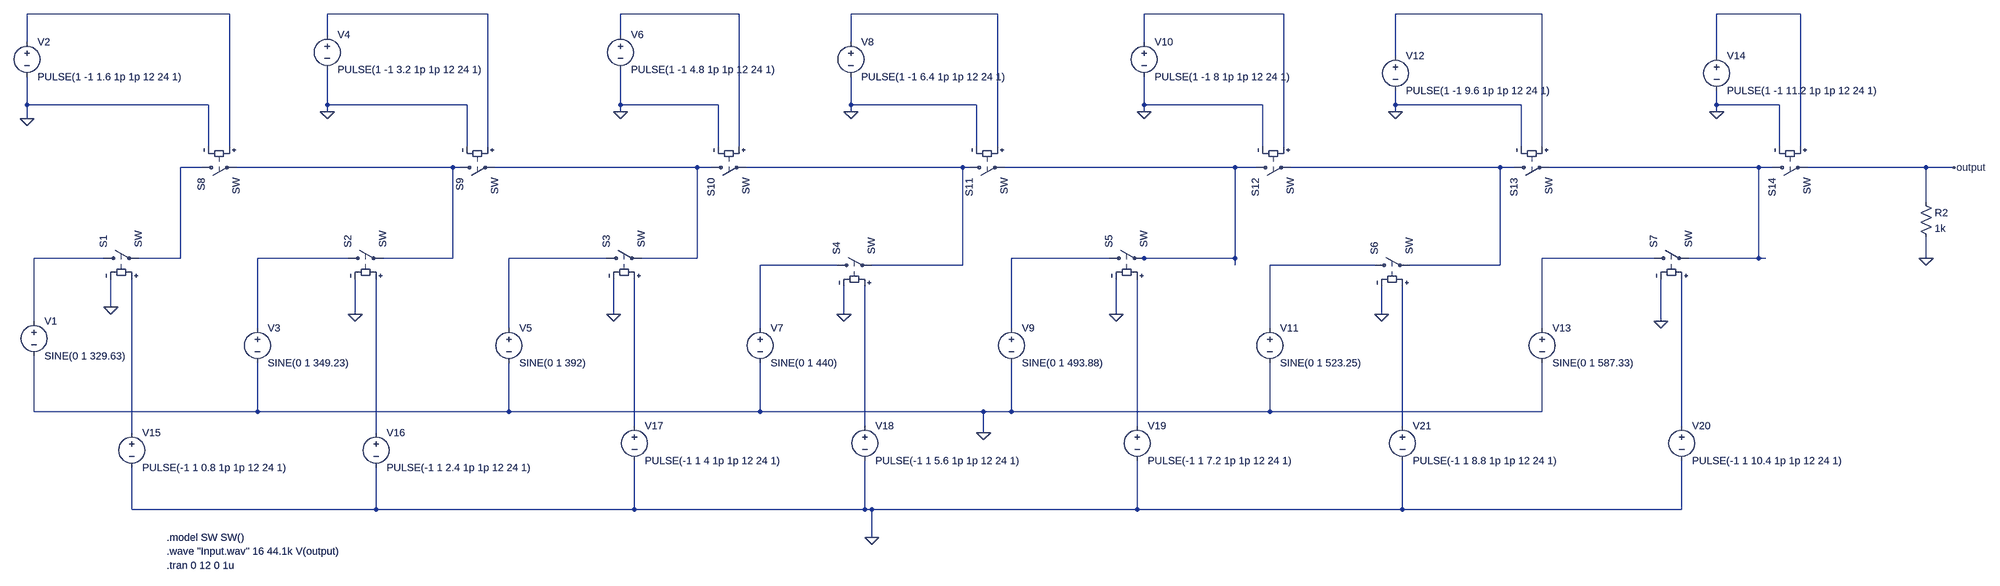
[diagram p0: schematic InputCircuit.asc]
InputCircuit.asc, the LTspice schematic file:
Version 4
SHEET 1 4720 688
WIRE 432 -592 -32 -592
WIRE 1024 -592 656 -592
WIRE 1600 -592 1328 -592
WIRE 2192 -592 1856 -592
WIRE 2848 -592 2528 -592
WIRE 3440 -592 3104 -592
WIRE 4032 -592 3840 -592
WIRE 656 -544 656 -592
WIRE 1328 -544 1328 -592
WIRE -32 -528 -32 -592
WIRE 1856 -528 1856 -592
WIRE 2528 -528 2528 -592
WIRE 3104 -496 3104 -592
WIRE 3840 -496 3840 -592
WIRE -32 -384 -32 -448
WIRE 384 -384 -32 -384
WIRE 656 -384 656 -464
WIRE 976 -384 656 -384
WIRE 1328 -384 1328 -464
WIRE 1552 -384 1328 -384
WIRE 1856 -384 1856 -448
WIRE 2144 -384 1856 -384
WIRE 2528 -384 2528 -448
WIRE 2800 -384 2528 -384
WIRE 3104 -384 3104 -416
WIRE 3392 -384 3104 -384
WIRE 3840 -384 3840 -416
WIRE 3984 -384 3840 -384
WIRE 656 -368 656 -384
WIRE 1328 -368 1328 -384
WIRE 1856 -368 1856 -384
WIRE 2528 -368 2528 -384
WIRE 3104 -368 3104 -384
WIRE 3840 -368 3840 -384
WIRE -32 -352 -32 -384
WIRE 384 -288 384 -384
WIRE 432 -288 432 -592
WIRE 976 -288 976 -384
WIRE 1024 -288 1024 -592
WIRE 1552 -288 1552 -384
WIRE 1600 -288 1600 -592
WIRE 2144 -288 2144 -384
WIRE 2192 -288 2192 -592
WIRE 2800 -288 2800 -384
WIRE 2848 -288 2848 -592
WIRE 3392 -288 3392 -384
WIRE 3440 -288 3440 -592
WIRE 3984 -288 3984 -384
WIRE 4032 -288 4032 -592
WIRE 368 -240 320 -240
WIRE 944 -240 448 -240
WIRE 960 -240 944 -240
WIRE 1504 -240 1040 -240
WIRE 1536 -240 1504 -240
WIRE 2112 -240 1616 -240
WIRE 2128 -240 2112 -240
WIRE 2736 -240 2208 -240
WIRE 2784 -240 2736 -240
WIRE 3344 -240 2864 -240
WIRE 3376 -240 3344 -240
WIRE 3936 -240 3456 -240
WIRE 3968 -240 3936 -240
WIRE 4320 -240 4048 -240
WIRE 4384 -240 4320 -240
WIRE 4320 -160 4320 -240
WIRE 144 -32 -16 -32
WIRE 320 -32 320 -240
WIRE 320 -32 224 -32
WIRE 704 -32 496 -32
WIRE 944 -32 944 -240
WIRE 944 -32 784 -32
WIRE 1296 -32 1072 -32
WIRE 1504 -32 1504 -240
WIRE 1504 -32 1376 -32
WIRE 2448 -32 2224 -32
WIRE 2528 -32 2512 -32
WIRE 2736 -32 2736 -240
WIRE 2736 -32 2528 -32
WIRE 3696 -32 3440 -32
WIRE 3936 -32 3936 -240
WIRE 3936 -32 3776 -32
WIRE 3952 -32 3936 -32
WIRE 4320 -32 4320 -80
WIRE 1824 -16 1648 -16
WIRE 2112 -16 2112 -240
WIRE 2112 -16 1904 -16
WIRE 2736 -16 2736 -32
WIRE 3056 -16 2816 -16
WIRE 3344 -16 3344 -240
WIRE 3344 -16 3136 -16
WIRE 160 80 160 16
WIRE 720 96 720 16
WIRE 1312 96 1312 16
WIRE 1840 96 1840 32
WIRE 2464 96 2464 16
WIRE 3072 96 3072 32
WIRE -16 112 -16 -32
WIRE 3712 112 3712 16
WIRE 496 128 496 -32
WIRE 1072 128 1072 -32
WIRE 1648 128 1648 -16
WIRE 2224 128 2224 -32
WIRE 2816 128 2816 -16
WIRE 3440 128 3440 -32
WIRE -16 320 -16 192
WIRE 496 320 496 208
WIRE 496 320 -16 320
WIRE 1072 320 1072 208
WIRE 1072 320 496 320
WIRE 1648 320 1648 208
WIRE 1648 320 1072 320
WIRE 2160 320 1648 320
WIRE 2224 320 2224 208
WIRE 2224 320 2160 320
WIRE 2816 320 2816 208
WIRE 2816 320 2224 320
WIRE 3440 320 3440 208
WIRE 3440 320 2816 320
WIRE 1360 352 1360 16
WIRE 1888 352 1888 32
WIRE 2512 352 2512 16
WIRE 3120 352 3120 32
WIRE 3760 352 3760 16
WIRE 208 368 208 16
WIRE 768 368 768 16
WIRE 2160 368 2160 320
WIRE 208 544 208 448
WIRE 768 544 768 448
WIRE 768 544 208 544
WIRE 1360 544 1360 432
WIRE 1360 544 768 544
WIRE 1888 544 1888 432
WIRE 1888 544 1360 544
WIRE 1904 544 1888 544
WIRE 2512 544 2512 432
WIRE 2512 544 1904 544
WIRE 3120 544 3120 432
WIRE 3120 544 2512 544
WIRE 3760 544 3760 432
WIRE 3760 544 3120 544
WIRE 1904 608 1904 544
FLAG 160 80 0
FLAG 720 96 0
FLAG 1312 96 0
FLAG 1840 96 0
FLAG 2464 96 0
FLAG 3072 96 0
FLAG 3712 112 0
FLAG 2160 368 0
FLAG 1904 608 0
FLAG 4384 -240 output
FLAG 3840 -368 0
FLAG 3104 -368 0
FLAG 2528 -368 0
FLAG 1856 -368 0
FLAG 1328 -368 0
FLAG 656 -368 0
FLAG -32 -352 0
FLAG 4320 -32 0
SYMBOL voltage -16 96 R0
WINDOW 123 0 0 Left 0
WINDOW 39 0 0 Left 0
SYMATTR InstName V1
SYMATTR Value SINE(0 1 329.63)
SYMBOL voltage -32 -544 R0
WINDOW 123 0 0 Left 0
WINDOW 39 0 0 Left 0
SYMATTR InstName V2
SYMATTR Value PULSE(1 -1 1.6 1p 1p 12 24 1)
SYMBOL voltage 496 112 R0
WINDOW 123 0 0 Left 0
WINDOW 39 0 0 Left 0
SYMATTR InstName V3
SYMATTR Value SINE(0 1 349.23)
SYMBOL voltage 656 -560 R0
WINDOW 123 0 0 Left 0
WINDOW 39 0 0 Left 0
SYMATTR InstName V4
SYMATTR Value PULSE(1 -1 3.2 1p 1p 12 24 1)
SYMBOL voltage 1072 112 R0
WINDOW 123 0 0 Left 0
WINDOW 39 0 0 Left 0
SYMATTR InstName V5
SYMATTR Value SINE(0 1 392)
SYMBOL voltage 1328 -560 R0
WINDOW 123 0 0 Left 0
WINDOW 39 0 0 Left 0
SYMATTR InstName V6
SYMATTR Value PULSE(1 -1 4.8 1p 1p 12 24 1)
SYMBOL voltage 1648 112 R0
WINDOW 123 0 0 Left 0
WINDOW 39 0 0 Left 0
SYMATTR InstName V7
SYMATTR Value SINE(0 1 440)
SYMBOL voltage 1856 -544 R0
WINDOW 123 0 0 Left 0
WINDOW 39 0 0 Left 0
SYMATTR InstName V8
SYMATTR Value PULSE(1 -1 6.4 1p 1p 12 24 1)
SYMBOL voltage 2224 112 R0
WINDOW 123 0 0 Left 0
WINDOW 39 0 0 Left 0
SYMATTR InstName V9
SYMATTR Value SINE(0 1 493.88)
SYMBOL voltage 2528 -544 R0
WINDOW 123 0 0 Left 0
WINDOW 39 0 0 Left 0
SYMATTR InstName V10
SYMATTR Value PULSE(1 -1 8 1p 1p 12 24 1)
SYMBOL voltage 2816 112 R0
WINDOW 123 0 0 Left 0
WINDOW 39 0 0 Left 0
SYMATTR InstName V11
SYMATTR Value SINE(0 1 523.25)
SYMBOL voltage 3104 -512 R0
WINDOW 123 0 0 Left 0
WINDOW 39 0 0 Left 0
SYMATTR InstName V12
SYMATTR Value PULSE(1 -1 9.6 1p 1p 12 24 1)
SYMBOL voltage 3440 112 R0
WINDOW 123 0 0 Left 0
WINDOW 39 0 0 Left 0
SYMATTR InstName V13
SYMATTR Value SINE(0 1 587.33)
SYMBOL voltage 3840 -512 R0
WINDOW 123 0 0 Left 0
WINDOW 39 0 0 Left 0
SYMATTR InstName V14
SYMATTR Value PULSE(1 -1 11.2 1p 1p 12 24 1)
SYMBOL sw 128 -32 R270
SYMATTR InstName S1
SYMBOL sw 688 -32 R270
SYMATTR InstName S2
SYMBOL sw 1280 -32 R270
SYMATTR InstName S3
SYMBOL sw 1808 -16 R270
SYMATTR InstName S4
SYMBOL sw 2432 -32 R270
SYMATTR InstName S5
SYMBOL sw 3040 -16 R270
SYMATTR InstName S6
SYMBOL sw 3680 -32 R270
SYMATTR InstName S7
SYMBOL sw 352 -240 M90
SYMATTR InstName S8
SYMBOL sw 944 -240 M90
SYMATTR InstName S9
SYMBOL sw 1520 -240 M90
SYMATTR InstName S10
SYMBOL sw 2112 -240 M90
SYMATTR InstName S11
SYMBOL sw 2768 -240 M90
SYMATTR InstName S12
SYMBOL sw 3360 -240 M90
SYMATTR InstName S13
SYMBOL sw 3952 -240 M90
SYMATTR InstName S14
SYMBOL voltage 208 352 R0
WINDOW 123 0 0 Left 0
WINDOW 39 0 0 Left 0
SYMATTR InstName V15
SYMATTR Value PULSE(-1 1 0.8 1p 1p 12 24 1)
SYMBOL voltage 768 352 R0
WINDOW 123 0 0 Left 0
WINDOW 39 0 0 Left 0
SYMATTR InstName V16
SYMATTR Value PULSE(-1 1 2.4 1p 1p 12 24 1)
SYMBOL voltage 1360 336 R0
WINDOW 123 0 0 Left 0
WINDOW 39 0 0 Left 0
SYMATTR InstName V17
SYMATTR Value PULSE(-1 1 4 1p 1p 12 24 1)
SYMBOL voltage 1888 336 R0
WINDOW 123 0 0 Left 0
WINDOW 39 0 0 Left 0
SYMATTR InstName V18
SYMATTR Value PULSE(-1 1 5.6 1p 1p 12 24 1)
SYMBOL voltage 2512 336 R0
WINDOW 123 0 0 Left 0
WINDOW 39 0 0 Left 0
SYMATTR InstName V19
SYMATTR Value PULSE(-1 1 7.2 1p 1p 12 24 1)
SYMBOL voltage 3760 336 R0
WINDOW 123 0 0 Left 0
WINDOW 39 0 0 Left 0
SYMATTR InstName V20
SYMATTR Value PULSE(-1 1 10.4 1p 1p 12 24 1)
SYMBOL voltage 3120 336 R0
WINDOW 123 0 0 Left 0
WINDOW 39 0 0 Left 0
SYMATTR InstName V21
SYMATTR Value PULSE(-1 1 8.8 1p 1p 12 24 1)
SYMBOL res 4304 -176 R0
SYMATTR InstName R2
SYMATTR Value 1k
TEXT 288 640 Left 2 !.wave "Input.wav" 16 44.1k V(output)
TEXT 288 608 Left 2 !.model SW SW()
TEXT 288 672 Left 2 !.tran 0 12 0 1u

The netlist it stands for:
* InputCircuit.asc
V1 N015 0 SINE(0 1 329.63)
V2 N001 0 PULSE(1 -1 1.6 1p 1p 12 24 1)
V3 N016 0 SINE(0 1 349.23)
V4 N002 0 PULSE(1 -1 3.2 1p 1p 12 24 1)
V5 N017 0 SINE(0 1 392)
V6 N003 0 PULSE(1 -1 4.8 1p 1p 12 24 1)
V7 N020 0 SINE(0 1 440)
V8 N004 0 PULSE(1 -1 6.4 1p 1p 12 24 1)
V9 N018 0 SINE(0 1 493.88)
V10 N005 0 PULSE(1 -1 8 1p 1p 12 24 1)
V11 N021 0 SINE(0 1 523.25)
V12 N006 0 PULSE(1 -1 9.6 1p 1p 12 24 1)
V13 N019 0 SINE(0 1 587.33)
V14 N007 0 PULSE(1 -1 11.2 1p 1p 12 24 1)
S1 N015 N008 N027 0 SW
S2 N016 N009 N028 0 SW
S3 N017 N010 N022 0 SW
S4 N020 N011 N023 0 SW
S5 N018 N012 N024 0 SW
S6 N021 N013 N025 0 SW
S7 N019 N014 N026 0 SW
S8 N008 N009 N001 0 SW
S9 N009 N010 N002 0 SW
S10 N010 N011 N003 0 SW
S11 N011 N012 N004 0 SW
S12 N012 N013 N005 0 SW
S13 N013 N014 N006 0 SW
S14 N014 output N007 0 SW
V15 N027 0 PULSE(-1 1 0.8 1p 1p 12 24 1)
V16 N028 0 PULSE(-1 1 2.4 1p 1p 12 24 1)
V17 N022 0 PULSE(-1 1 4 1p 1p 12 24 1)
V18 N023 0 PULSE(-1 1 5.6 1p 1p 12 24 1)
V19 N024 0 PULSE(-1 1 7.2 1p 1p 12 24 1)
V20 N026 0 PULSE(-1 1 10.4 1p 1p 12 24 1)
V21 N025 0 PULSE(-1 1 8.8 1p 1p 12 24 1)
R2 output 0 1k
.wave "Input.wav" 16 44.1k V(output)
.model SW SW()
.tran 0 12 0 1u
.backanno
.end